# EAGLE schematic trace_mockup (EAGLE 9.2.2)
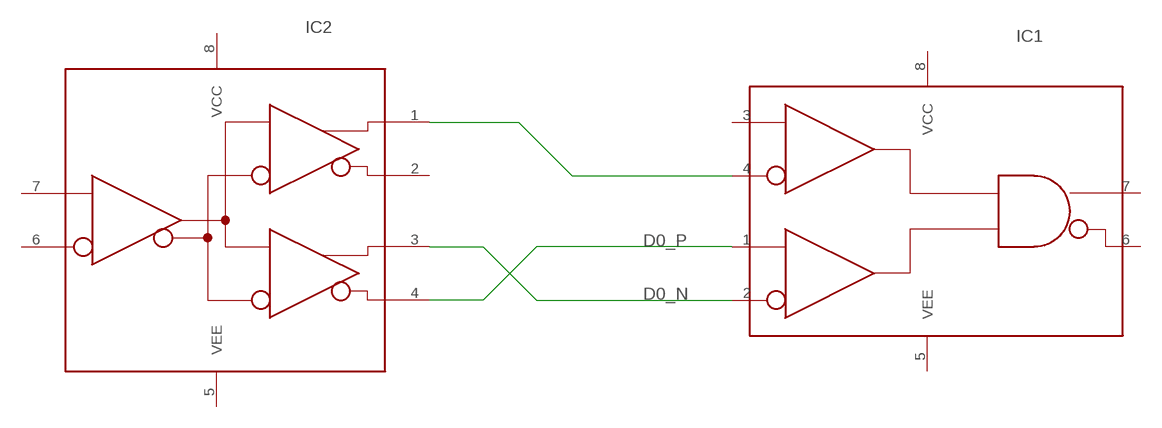
[diagram p0: schematic, sheet 1]

## Parts
IC1  SY10EP05V  [SOIC8]
IC2  SY10EP11U  [SOIC8]

## Nets
D0_N: IC1.2(!D0!) IC2.3(Q1)
D0_P: IC1.1(D0) IC2.4(!Q1!)
N$1: IC1.4(!D1!) IC2.1(Q0)
Unconnected: IC1.3(D1) IC1.5(VEE) IC1.6(!Q!) IC1.7(Q) IC1.8(VCC) IC2.2(!Q0!) IC2.5(VEE) IC2.6(!D!) IC2.7(D) IC2.8(VCC)

## Library data of the parts
IC1 = yapo:SY10EP05V
IC2 = yapo:SY10EP11U

## Net classes
1 100-ohm-pari: width 0.991 mm, drill 0.254 mm, clearance 0.254 mm
2 50-ohm: width 2.87 mm, clearance 8.611 mm